# EAGLE design programmer (EAGLE 9.6.2)
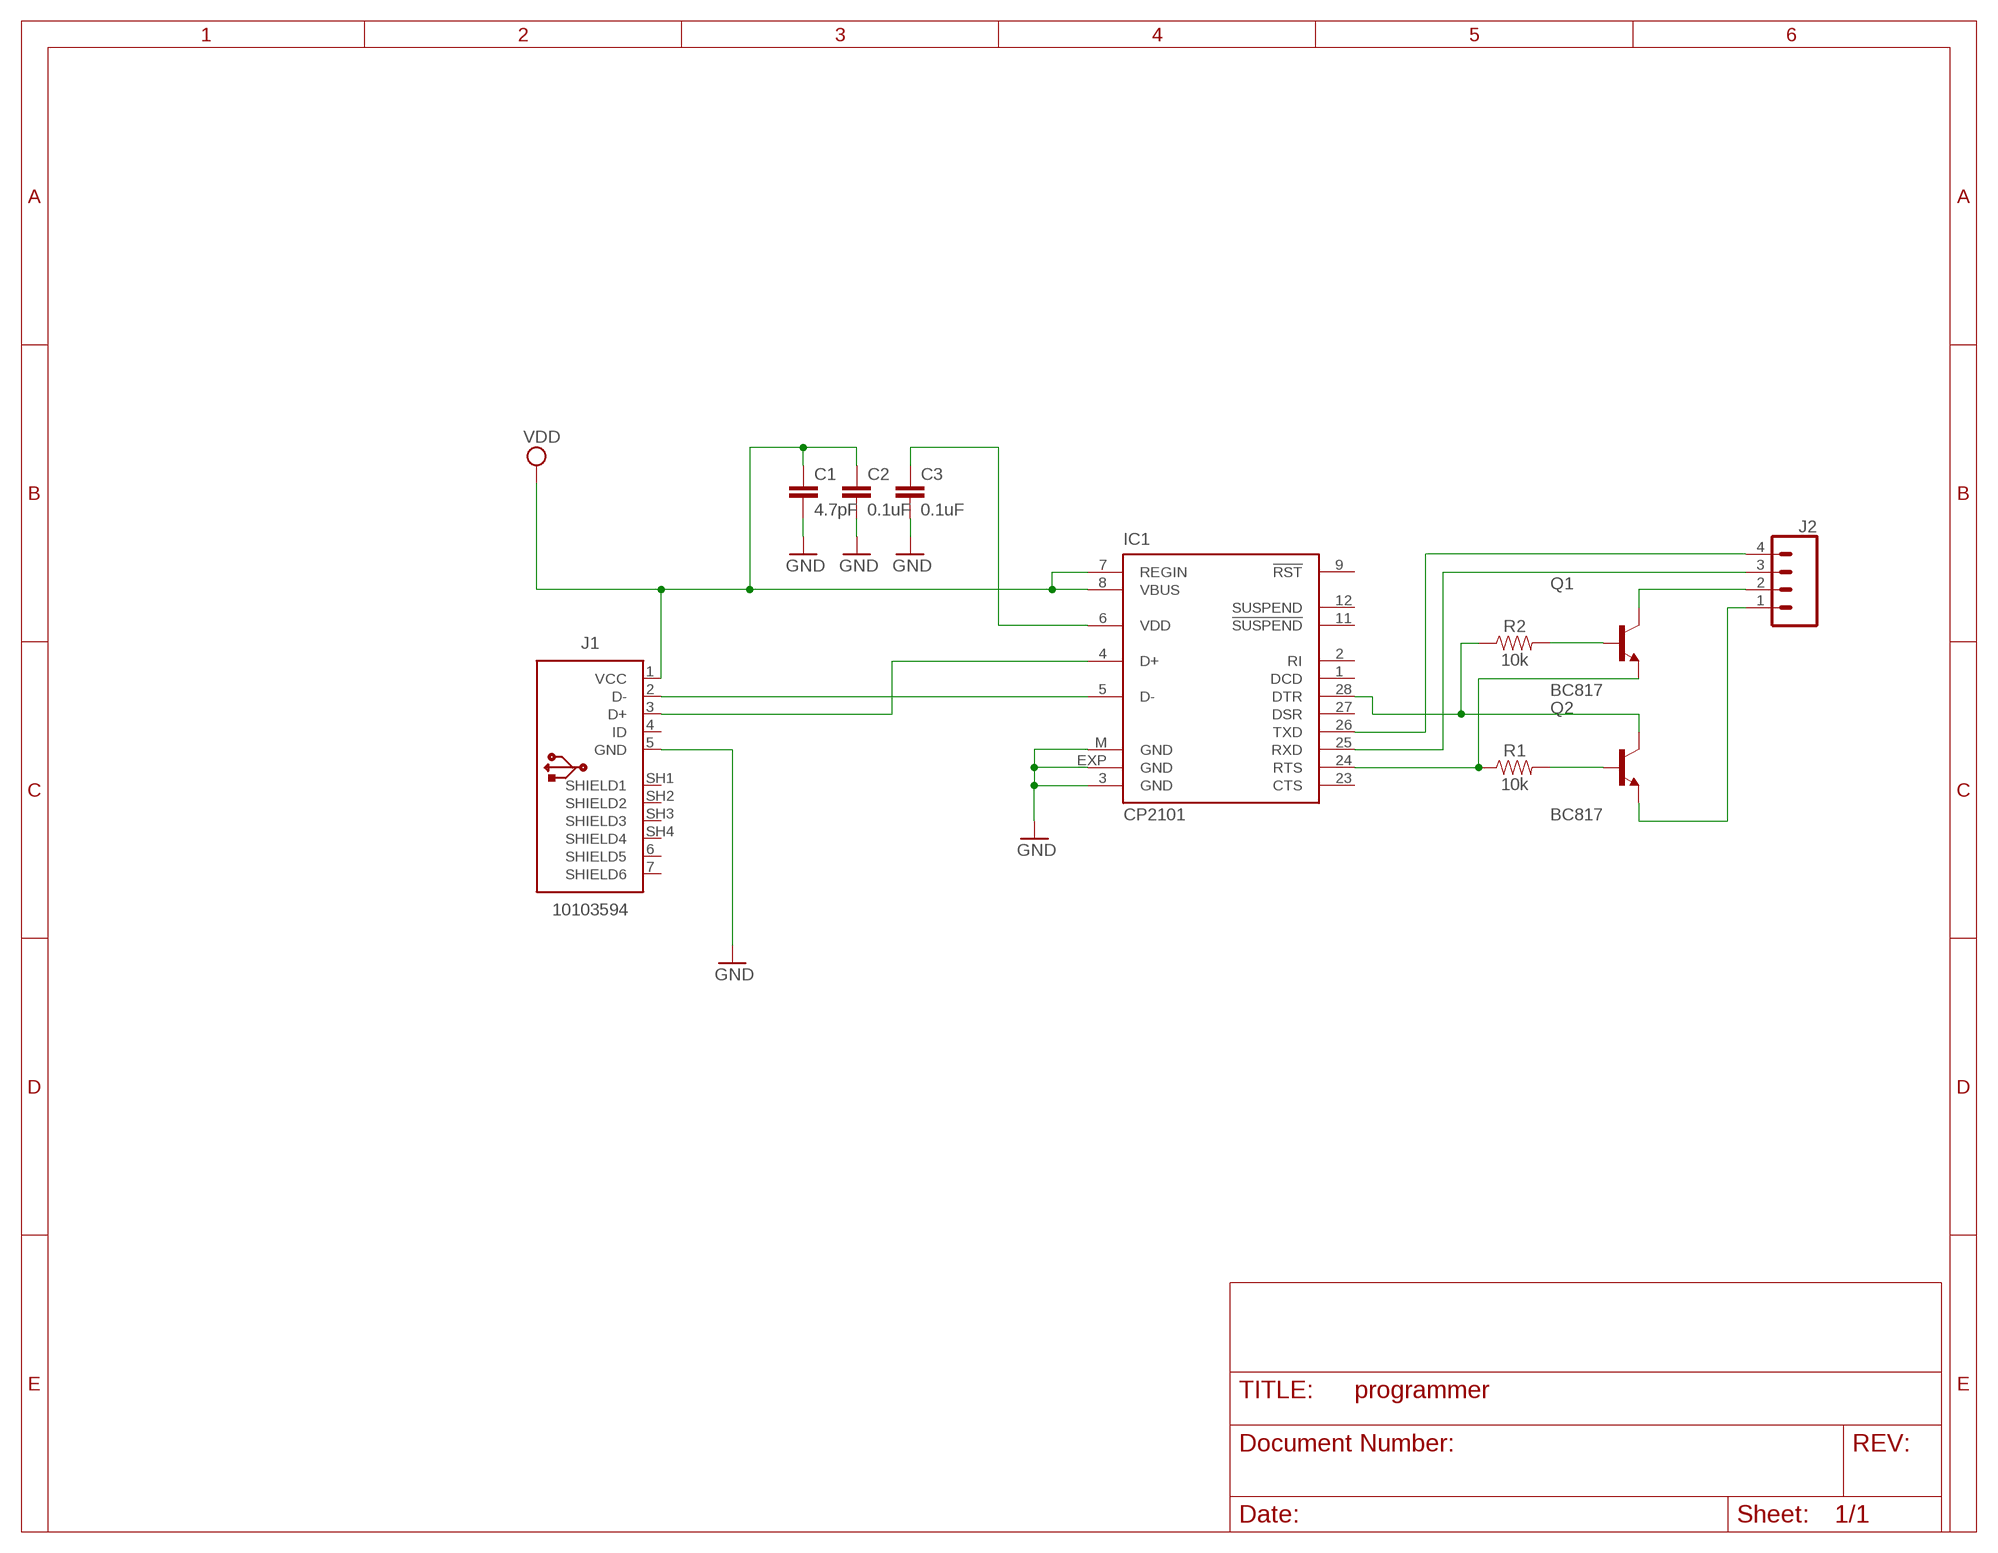
[diagram p0: schematic, sheet 1]

## Parts
C1  4.7pF  4.7PF-0603-50V-5%  [0603]
C2  0.1uF  0.1UF-0402-16V-10%  [0402]
C3  0.1uF  0.1UF-0402-16V-10%  [0402]
IC1  CP2101  [MLP28]
J1  10103594  [10103594]
J2  CONN_04  [1X04]
Q1  BC817  [SOT95P230X110-3N]
Q2  BC817  [SOT95P230X110-3N]
R1  10k  10KOHM-HORIZ-1/4W-1%  [AXIAL-0.3]
R2  10k  10KOHM-HORIZ-1/4W-1%  [AXIAL-0.3]

## Nets
GND: C1.2 C2.2 C3.2 IC1.3(GND) IC1.EXP(GND) IC1.M(GND) J1.5(GND)
N$1: IC1.5(D-) J1.2(D-)
N$2: IC1.4(D+) J1.3(D+)
N$3: IC1.25(RXD) J2.3
N$4: IC1.26(TXD) J2.4
N$5: C3.1 IC1.6(VDD)
N$6: J2.2 Q1.3(C)
N$7: IC1.28(DTR) Q2.3(C) R2.P$1
N$8: J2.1 Q2.2(E)
N$9: IC1.24(RTS) Q1.2(E) R1.P$1
N$11: Q2.1(B) R1.P$2
N$12: Q1.1(B) R2.P$2
VDD: C1.1 C2.1 IC1.7(REGIN) IC1.8(VBUS) J1.1(VCC)
Unconnected: IC1.1(DCD) IC1.2(RI) IC1.9(!RST) IC1.11(!SUSPEND) IC1.12(SUSPEND) IC1.23(CTS) IC1.27(DSR) J1.4(ID) J1.6(SHIELD5) J1.7(SHIELD6) J1.SH1(SHIELD1) J1.SH2(SHIELD2) J1.SH3(SHIELD3) J1.SH4(SHIELD4)

## Library data of the parts
C1 = SparkFun-Capacitors:4.7PF: 4.7pF ceramic capacitors A capacitor is a passive two-terminal electrical component used to store electrical energy temporarily in an electric field.; PROD_ID: CAP-07880
C2 C3 = SparkFun-Capacitors:0.1UF: 0.1µF ceramic capacitors A capacitor is a passive two-terminal electrical component used to store electrical energy temporarily in an electric field.; PROD_ID: CAP-12416
IC1 = silabs:CP210*: Single-Chip USB to UART Bridge Source: www.silabs.com .. CP2101.pdf / cp2102.pdf; MF: FARNELL; MPN: CP2102-GM; OC_FARNELL: 9282130; OC_NEWARK: 30K5635
J1 = Connector_USB:10103594: USB(2.0) Micro-B, RCPT, 5POS, SMD-THT-R/A Datasheet <https://cdn.amphenol-icc.com/media/wysiwyg/files/documentation/datasheet/inputoutput/io_usb_micro.pdf> Drawing <https://cdn.amphenol-icc.com/media/wysiwyg/files/drawing/10103594.pdf>; CATEGORY: Connectors; CONTACTS: 5; CURRENT-RATING: 1.8A; DESCRIPTION: CONN RCPT USB2.0 MICRO B SMD R/A; GENDER: Receptacle; MANUFACTURER: Amphenol ICC (FCI); MOUNT_TYPE: R/A; MPN: 10103594-0001LF; OPERATING_TEMPERATURE: -30°C ~ 80°C; PART_STATUS: ACTIVE; ROHS_COMPLIANT: COMPLIANT; SUB_CATEGORY: USB; TYPE: USB-micro B; VOLTAGE-RATING: 100VAC
J2 = SparkFun-Connectors:CONN_04: Multi connection point. Often used as Generic Header-pin footprint for 0.1 inch spaced/style header connections On any of the 0.1 inch spaced packages, you can populate with these: Break Away Headers - Straight <https://www.sparkfun.com/products/116> (PRT-00116) Break Away Male Headers - Right Angle <https://www.sparkfun.com/products/553> (PRT-00553) Female Headers <https://www.sparkfun.com/products/115> (PRT-00115) Break Away Headers - Machine Pin <https://www.sparkfun.com/products/117> (PRT-00117) Break Away Female Headers - Swiss Machine Pin <https://www.sparkfun.com/products/743> (PRT-00743) For SCREWTERMINALS and SPRING TERMINALS visit here: Screw Terimnals on SparkFun.com <https://www.sparkfun.com/search/results?term=Screw+Terminals> (5mm/3.5mm/2.54mm spacing) This device is also useful as a general connection point to wire up your design to another part of your project. Our various solder wires solder well into these plated through hole pads. Hook-Up Wire - Assortment (Stranded, 22 AWG) <https://www.sparkfun.com/products/11375> (PRT-11375) Hook-Up Wire - Assortment (Solid Core, 22 AWG) <https://www.sparkfun.com/products/11367> (PRT-11367) View the entire wire category on our website here <https://www.sparkfun.com/categories/141> Special notes: Molex polarized connector foot print use with SKU : PRT-08231 with associated crimp pins and housings. 1MM SMD Version SKU: PRT-10208; PROD_ID: CONN-09696
Q1 Q2 = BC817:BC817: Transistor, Npn, 0.5a, 45v, Sot23 Check availability <https://pricing.snapeda.com/parts/BC817/Rectron/view-part?ref=eda>; AVAILABILITY: In Stock; DESCRIPTION: TRANS NPN 45V 0.5A SOT-23; MF: Rectron; MP: BC817; PACKAGE: SOT-23-3 Rectron; PRICE: None
R1 R2 = SparkFun-Resistors:10KOHM: 10kΩ resistor A resistor is a passive two-terminal electrical component that implements electrical resistance as a circuit element. Resistors act to reduce current flow, and, at the same time, act to lower voltage levels within circuits. - Wikipedia; PROD_ID: RES-12183

## Board
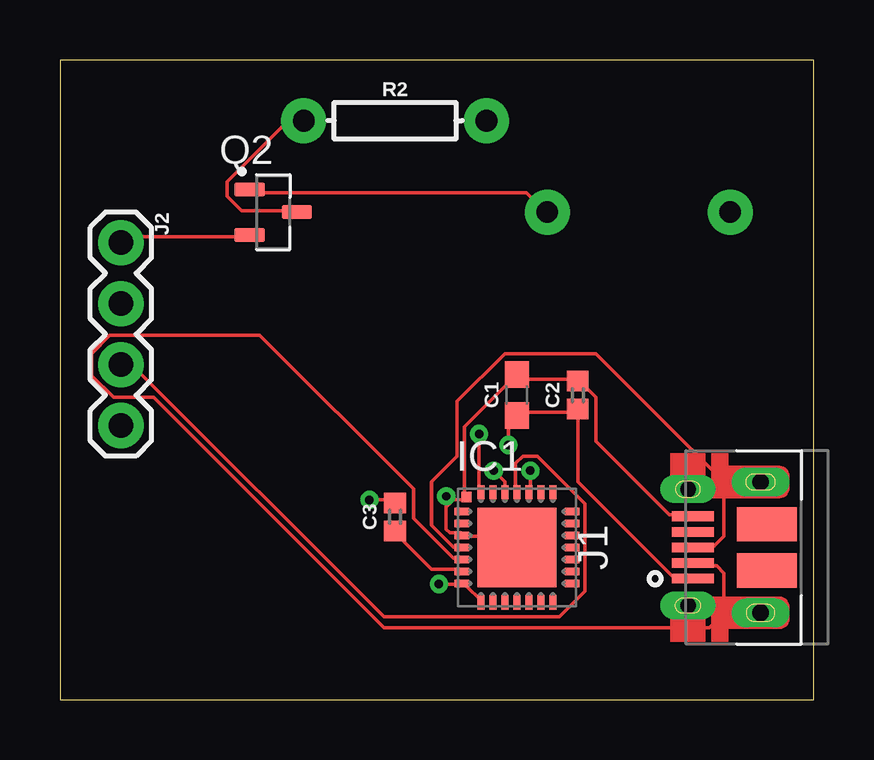
[diagram p1: board, top side]
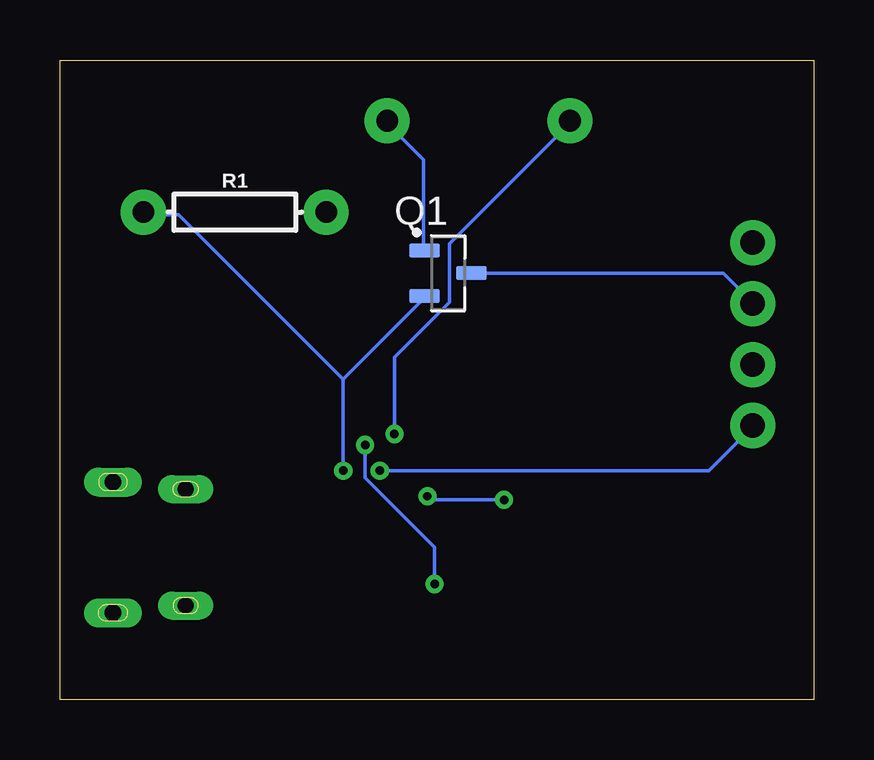
[diagram p2: board, bottom side, seen from below]

Size 31.42 x 26.66 mm. Coordinates in mm from the lower left corner, seen from the top.
Outline: 0,0 31.42,0 31.42,26.66 0,26.66 0,0
Copper layers (1*16): Top 0.035mm / dielectric 1.5mm / Bottom 0.035mm
Design rules "default": minimum track width 6mil, minimum drill 0.35mm, track to track 6mil, track to pad 6mil, pad to pad 6mil, via to via 6mil, smd to smd 6mil, copper to edge 40mil, drill to drill 6mil, minimum pad ring 10mil, minimum via ring 8mil, stop-mask expansion 4mil, vias tented up to drill 0mil, thermal gap 10mil

### Footprints (pad centres in the part's own frame; a part is rotated, then mirrored left to right if it is on the bottom)
0603 = smd 1.1 x 1: 1 -0.85,0; 2 0.85,0
0402 = smd 0.85 x 0.9: 1 -0.58,0; 2 0.58,0
MLP28 = smd 0.6 x 0.3: 1 -2.3,1.5; 2 -2.3,1; 3 -2.3,0.5; 4 -2.3,0; 5 -2.3,-0.5; 6 -2.3,-1; 7 -2.3,-1.5; 15 2.3,-1.5; 16 2.3,-1; 17 2.3,-0.5; 18 2.3,0; 19 2.3,0.5; 20 2.3,1; 21 2.3,1.5 | smd 0.3 x 0.6: 8 -1.5,-2.3; 9 -1,-2.3; 10 -0.5,-2.3; 11 0,-2.3; 12 0.5,-2.3; 13 1,-2.3; 14 1.5,-2.3; 22 1.5,2.3; 23 1,2.3; 24 0.5,2.3; 25 0,2.3; 26 -0.5,2.3; 27 -1,2.3; 28 -1.5,2.3 | smd 3.3 x 3.3: EXP 0,0 | smd 0.435 x 0.435: M -2.103,2.103
10103594 = smd 0.4 x 1.75: 1 -1.3,2.825; 2 -0.65,2.825; 3 0,2.825; 4 0.65,2.825; 5 1.3,2.825 | smd 1.425 x 2.5: 6 -0.963,-0.25; 7 0.963,-0.25 | drill 0.65 pad 0.73 long: SH1 -2.425,3.03; SH2 2.425,3.03 | drill 0.7 long: SH3 -2.725,0; SH4 2.725,0
1X04 = drill 1.016 pad 1.88: 1 0,0; 2 2.54,0; 3 5.08,0; 4 7.62,0
SOT95P230X110-3N = smd 1.26 x 0.59: 1 -0.98,0.95; 2 -0.98,-0.95; 3 0.98,0
AXIAL-0.3 = drill 0.9 pad 1.88: P$1 -3.81,0; P$2 3.81,0

### Placement (x,y rotation side)
C1  19.05,12.7 90 top
C2  21.59,12.7 90 top
C3  13.97,7.62 90 top
IC1  19.05,6.35 0 top
J1  29.21,6.35 90 top
J2  2.54,19.05 270 top
Q1  15.24,17.78 0 bottom
Q2  8.89,20.32 0 top
R1  24.13,20.32 0 bottom
R2  13.97,24.13 0 top

### Tracks (layer width: path | path; a pad name or v marks a point on that pad's centre or on a via)
GND  (via drill 0.35)
  Top 0.152: 16.1,8.03 16.41,8.33 16.87,8.33 IC1.M 16.87,8.48 16.87,11.38 19,13.51 C1.2 19.15,13.51 19.3,13.36 21.59,13.36 | 16.1,8.03 16.1,7.11 16.26,6.96 16.71,6.96 IC1.3 16.87,6.81 18.54,6.81 19,6.35 IC1.EXP | v12.9,8.33 13.97,8.33 C3.2 | 16.1,8.03 v16.1,8.48 | 21.59,13.36 22.35,12.6 22.35,10.77 25.4,7.72 26.31,7.72 J1.5 | 21.59,13.36 C2.2
  Bottom 0.152: v12.9,8.33 15.95,8.33 v16.1,8.48
N$1
  Top 0.152: IC1.5 16.71,5.89 16.41,5.89 14.73,7.57 14.73,8.79 8.33,15.19 2.08,15.19 1.32,14.43 1.32,13.51 2.23,12.6 3.91,12.6 13.51,3 27.08,3 27.69,3.61 27.69,5.28 27.38,5.59 26.47,5.59 J1.2
N$2
  Top 0.152: IC1.4 16.41,6.35 15.49,7.26 15.49,9.09 16.56,10.16 16.56,12.45 18.54,14.43 22.35,14.43 27.69,9.09 27.69,6.81 27.23,6.35 J1.3
N$3
  Top 0.152: J2.3 3,13.97 13.51,3.45 20.83,3.45 21.89,4.52 21.89,8.18 19.91,10.16 19.3,10.16 19,9.86 19,8.79 IC1.25
N$4  (via drill 0.35)
  Top 0.152: v18.09,9.55 18.54,9.09 18.54,8.79 IC1.26
  Bottom 0.152: v18.09,9.55 4.37,9.55 2.54,11.38 J2.4
N$5
  Top 0.152: IC1.6 16.71,5.44 15.49,5.44 13.97,6.96 C3.1
N$6
  Bottom 0.152: Q1.3 3.76,17.78 2.54,16.56 J2.2
N$7  (via drill 0.35)
  Top 0.152: v17.48,11.07 17.48,8.79 IC1.28 | Q2.3 9.86,20.37 7.57,20.37 6.96,20.98 6.96,21.59 9.4,24.03 10.16,24.03 R2.P$1
  Bottom 0.152: v17.48,11.07 17.48,14.28 15.19,16.56 15.19,19 10.16,24.03 R2.P$1
N$8
  Top 0.152: Q2.2 7.87,19.3 2.69,19.3 2.54,19.15 J2.1
N$9  (via drill 0.35)
  Top 0.152: v19.61,9.55 19.61,8.79 IC1.24
  Bottom 0.152: 19.61,13.36 v19.61,9.55 | 19.61,13.36 16.26,16.71 Q1.2 | 19.61,13.36 26.47,20.22 27.84,20.22 R1.P$1
N$11
  Top 0.152: Q2.1 8.03,21.13 19.46,21.13 20.22,20.37 R1.P$2
N$12
  Bottom 0.152: Q1.1 16.26,18.85 16.26,22.5 17.78,24.03 R2.P$2
VDD  (via drill 0.35)
  Top 0.152: IC1.8 17.63,4.06 16.87,4.83 IC1.7 16.71,4.83 v15.8,4.83 | 21.59,11.99 19.15,11.99 C1.1 19,11.84 18.69,11.53 v18.69,10.62 | 21.59,11.99 21.59,9.09 25.55,5.13 26.31,5.13 J1.1 | 21.59,11.99 C2.1
  Bottom 0.152: v15.8,4.83 15.8,6.35 18.69,9.25 v18.69,10.62